# Altium schematic sheet [03] - POWER.SchDoc
size A4
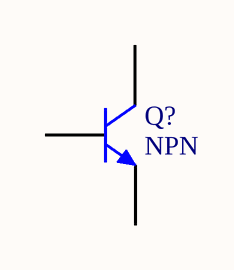
[diagram p0: [03] - POWER.SchDoc]

## Parts
Q?  NPN  [TO-226-AA]

## Nets

Not connected (* = marked no-connect by the designer): Q? 1(C) 2(B) 3(E)

## Library data of the parts
Q? = NPN: NPN Bipolar Transistor; Published: 8-Jun-2000; LatestRevisionDate: 17-Jul-2002; LatestRevisionNote: Re-released for DXP Platform.; PackageReference: TO-226-AA; Publisher: Altium Limited; PackageDescription: TO, Flat Index; 3 In-Line, Axial Leads; Body Dia. 4.8mm; Leads 0.55 x 0.51 mm (max); Code_JEDEC: TO-226-AA